# Altium schematic sheet Microprocessor and CAN.SchDoc
size B; SheetNumber: 1; SheetTotal: 3
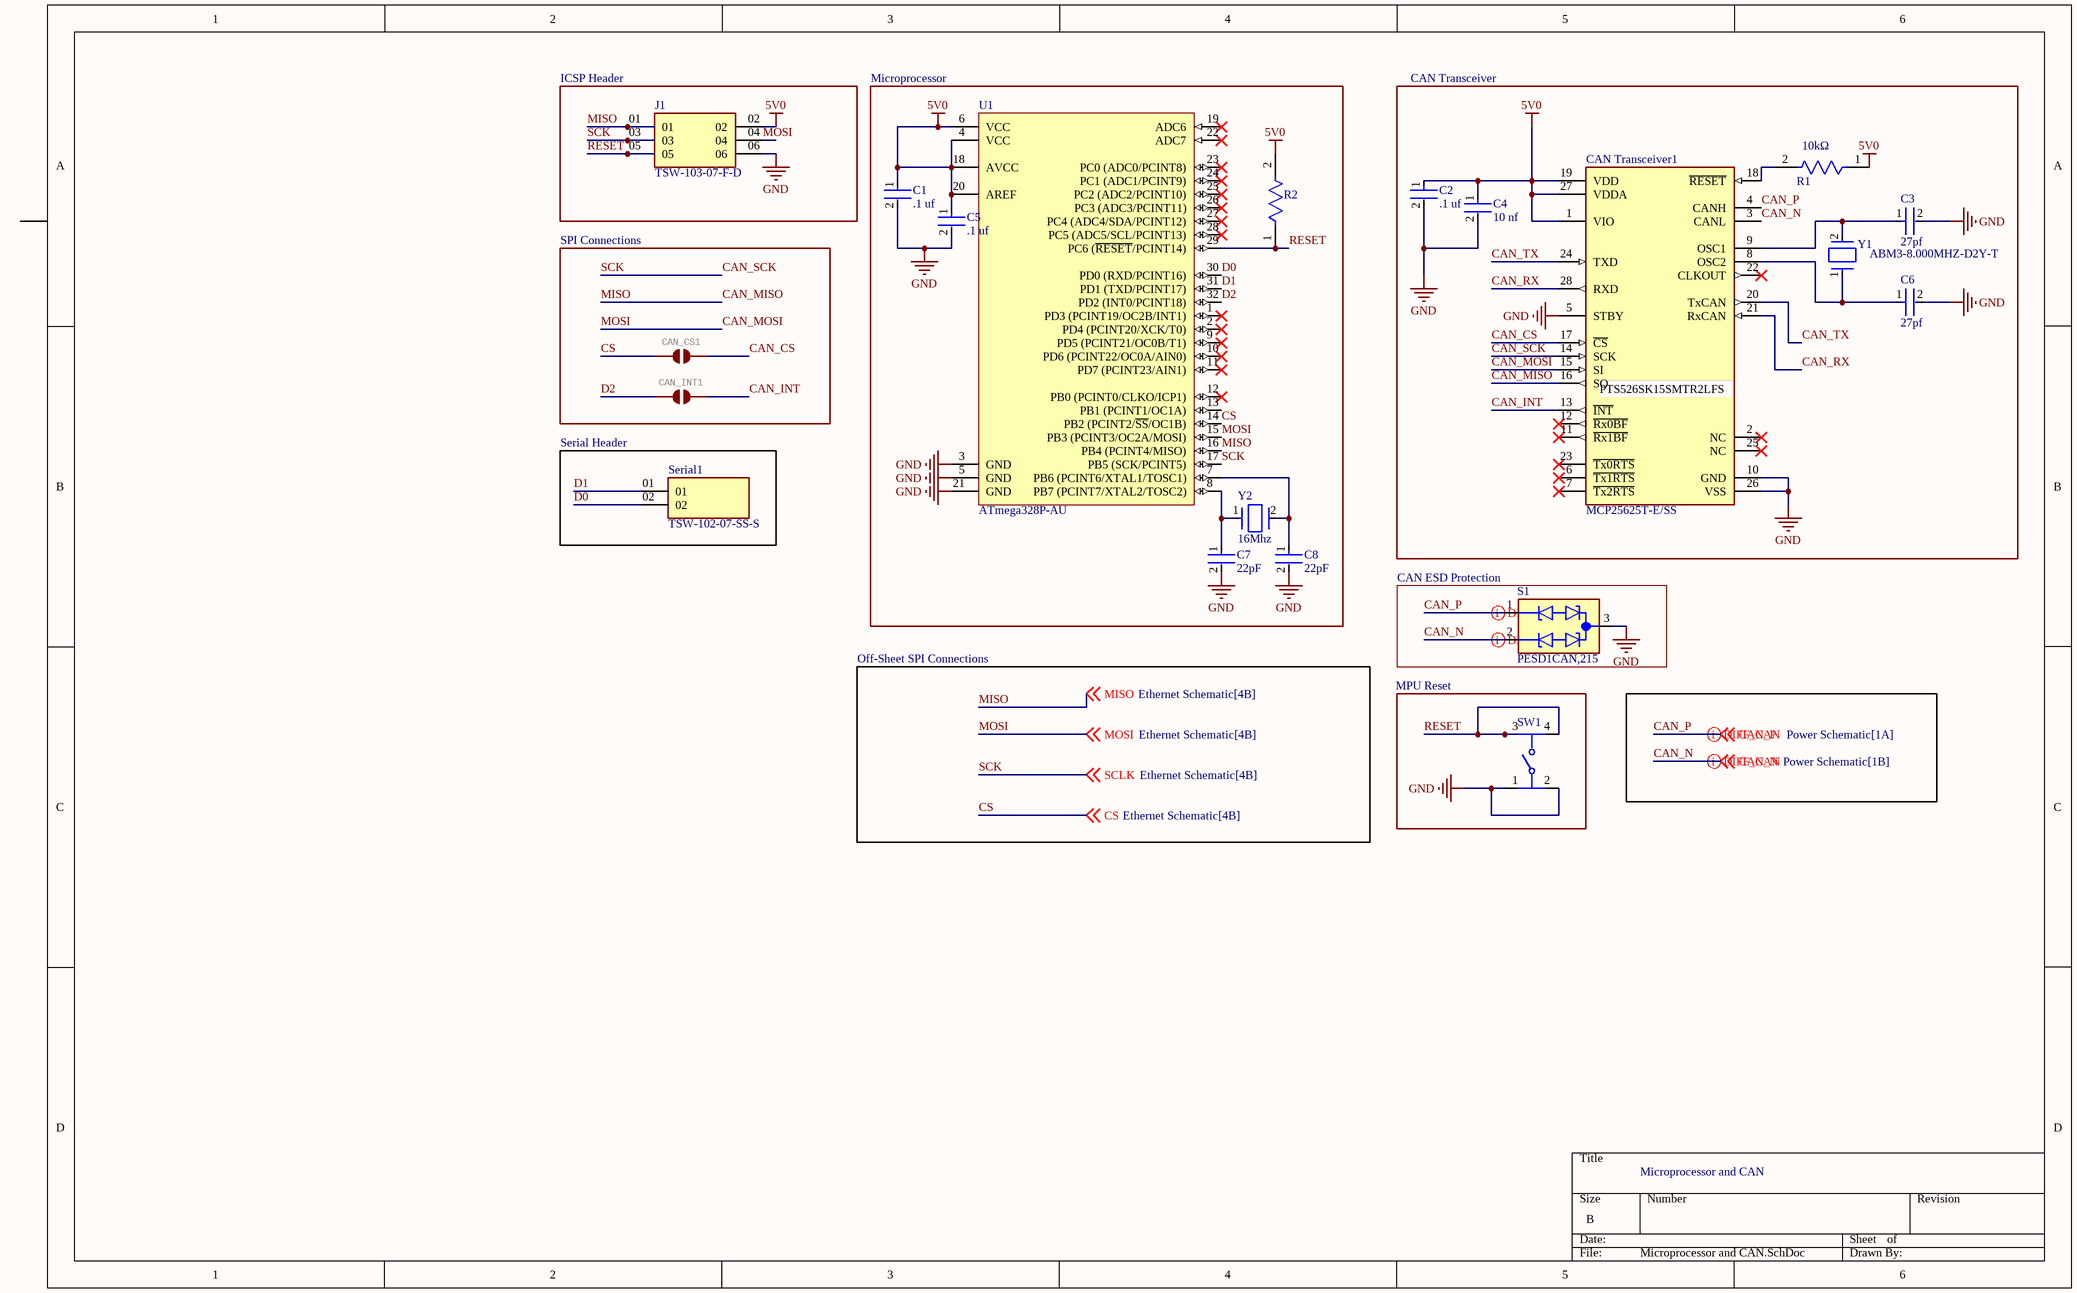
[diagram p0: Microprocessor and CAN.SchDoc]

## Parts
C1  .1 uf  [FP-0805-L_2_01_0_2-W_1_25-IPC_B]
C2  .1 uf  [FP-0805-L_2_01_0_2-W_1_25-IPC_B]
C3  27pf  [FP-GRM21B-0_15-IPC_C]
C4  10 nf  [FP-C0805C-DN-MFG]
C5  .1 uf  [FP-0805-L_2_01_0_2-W_1_25-IPC_B]
C6  27pf  [FP-GRM21B-0_15-IPC_C]
C7  22pF  [FP-C0805C-DN-MFG]
C8  22pF  [FP-C0805C-DN-MFG]
CAN_CS1  (no value)  [SMT-JUMPER_2_NO_SILK]
CAN_INT1  (no value)  [SMT-JUMPER_2_NO_SILK]
CAN_Transceiver1  MCP25625T-E/SS  [FP-C04-073-IPC_B]
J1  TSW-103-07-F-D  [SAMTEC_TSW-103-07-F-D]
R1  10kΩ  [FP-CRCW0805-e3-IPC_A]
R2  CRCW080510K0FKEA  [FP-CRCW0805-e3-IPC_A]  (value not drawn)
S1  PESD1CAN,215  [DIO_PESD1CAN,215]
Serial1  TSW-102-07-SS-S  [SAMTEC_TSW-102-07-SS-S]
SW1  PTS526SK15SMTR2LFS  [FP-PTS526SK15SMTR2LFS-MFG]  (value not drawn)
U1  ATmega328P-AU  [32A_M]
Y1  ABM3-8.000MHZ-D2Y-T  [FP-ABM3-MFG]
Y2  16Mhz  [FP-ABM3-MFG]

## Blocks framed on the sheet
ICSP Header: J1
Microprocessor: C1 C5 C7 C8 R2 U1 Y2
CAN Transceiver: C2-C4 C6 CAN_Transceiver1 R1 Y1
SPI Connections: CAN_CS1 CAN_INT1
Serial Header: Serial1
CAN ESD Protection: S1
MPU Reset: SW1

## Nets
5V0: C1.1 C2.1 C4.1 C5.1 CAN_Transceiver1.1(VIO) CAN_Transceiver1.19(VDD) CAN_Transceiver1.27(VDDA) J1.02 R1.1 R2.2 U1.4(VCC) U1.6(VCC) U1.18(AVCC) U1.20(AREF)
GND: C1.2 C2.2 C3.2 C4.2 C5.2 C6.2 C7.2 C8.2 CAN_Transceiver1.5(STBY) CAN_Transceiver1.10(GND) CAN_Transceiver1.26(VSS) J1.06 S1.3(CC) SW1.1 SW1.2 U1.3(GND) U1.5(GND) U1.21(GND)
CAN_CS: CAN_CS1.2 CAN_Transceiver1.17(~{CS})
CAN_INT: CAN_INT1.2 CAN_Transceiver1.13(~{INT})
CAN_MISO: CAN_Transceiver1.16(SO) J1.01 U1.16(PB4_(PCINT4/MISO)) ; off-sheet MISO  [also labelled MISO]
CAN_MOSI: CAN_Transceiver1.15(SI) J1.04 U1.15(PB3_(PCINT3/OC2A/MOSI)) ; off-sheet MOSI  [also labelled MOSI]
CAN_N: CAN_Transceiver1.3(CANL) S1.2(C2) ; off-sheet CAN_N
CAN_P: CAN_Transceiver1.4(CANH) S1.1(C1) ; off-sheet CAN_P
CAN_RX: CAN_Transceiver1.21(RxCAN) CAN_Transceiver1.28(RXD)
CAN_SCK: CAN_Transceiver1.14(SCK) J1.03 U1.17(PB5_(SCK/PCINT5)) ; off-sheet SCLK  [also labelled SCK, SCLK]
CAN_TX: CAN_Transceiver1.20(TxCAN) CAN_Transceiver1.24(TXD)
CS: CAN_CS1.1 U1.14(PB2_(PCINT2/~{SS}/OC1B)) ; off-sheet CS
D0: Serial1.02 U1.30(PD0_(RXD/PCINT16))
D1: Serial1.01 U1.31(PD1_(TXD/PCINT17))
D2: CAN_INT1.1 U1.32(PD2_(INT0/PCINT18))
RESET: J1.05 R2.1 SW1.3 SW1.4 U1.29(PC6_(~{RESET}/PCINT14))
NetC3_1: C3.1 CAN_Transceiver1.9(OSC1) Y1.2
NetC6_1: C6.1 CAN_Transceiver1.8(OSC2) Y1.1
NetC7_1: C7.1 U1.8(PB7_(PCINT7/XTAL2/TOSC2)) Y2.1
NetC8_1: C8.1 U1.7(PB6_(PCINT6/XTAL1/TOSC1)) Y2.2
NetCAN_Transceiver1_18: CAN_Transceiver1.18(~{RESET}) R1.2

Not connected (* = marked no-connect by the designer): CAN_Transceiver1 2(NC)* 6(~{Tx1RTS})* 7(~{Tx2RTS})* 11(~{Rx1BF})* 12(~{Rx0BF})* 22(CLKOUT)* 23(~{Tx0RTS})* 25(NC)*; U1 1(PD3_(PCINT19/OC2B/INT1))* 2(PD4_(PCINT20/XCK/T0))* 9(PD5_(PCINT21/OC0B/T1))* 10(PD6_(PCINT22/OC0A/AIN0))* 11(PD7_(PCINT23/AIN1))* 12(PB0_(PCINT0/CLKO/ICP1))* 13(PB1_(PCINT1/OC1A)) 19(ADC6)* 22(ADC7)* 23(PC0_(ADC0/PCINT8))* 24(PC1_(ADC1/PCINT9))* 25(PC2_(ADC2/PCINT10))* 26(PC3_(ADC3/PCINT11))* 27(PC4_(ADC4/SDA/PCINT12))* 28(PC5_(ADC5/SCL/PCINT13))*

## Layout directives
differential pair: CAN_N, CAN_P

## Notes on the sheet
- (near CAN_Transceiver1) PTS526SK15SMTR2LFS
- Off-Sheet SPI Connections
- Microprocessor and CAN

## Library data of the parts
C1 C2 C5 = CMP-2007-04174-2: General Purpose Ceramic Capacitor, 0805, 100nF, 10%, X7R, 15%, 100V; Packaging: Tape and Reel; Min Operating Temperature: -55°C; Dielectric Material: Ceramic; Height: 1.4mm; Voltage Rating: 100V; Termination: SMD/SMT; Case Code (Imperial): 0805; Case Code (Metric): 2012; Case/Package: 0805; Construction: Flat; Radiation Hardening: No; Series: -; Dielectric: X7R; Package Quantity: 2000; Mount: Surface Mount; Capacitance: 100nF; Contact Plating: Tin; Voltage: 100V; Lead Free: Lead Free; Depth: 1.25mm; RoHS Compliant: Yes; Number of Pins: 2; Max Operating Temperature: 125°C; Length: 2.01mm; Voltage Rating (DC): 100V; Thickness: 0.055inch; REACH SVHC: No SVHC; Width: 0.049inch; Tolerance: 10%
C3 C6 = CMP-2007-03541-2: Chip Multilayer Ceramic Capacitors for General Purpose, 0805, 10uF, X5R, 15%, 10%, 25V; Length: 2mm; Depth: 1.25mm; Termination: SMD/SMT; Voltage: 25V; Height: 1.25mm; Material: Ceramic; Thickness: 0.053inch; Radiation Hardening: No; Min Operating Temperature: -55°C; Width: 0.049inch; Package Quantity: 1; Mount: Surface Mount; Dielectric: X5R; Packaging: Tape and Reel; Capacitance: 10uF; Voltage Rating (DC): 25V; Lead Free: Lead Free; Max Operating Temperature: 85°C; Case Code (Imperial): 0805; Case/Package: 0805; Tolerance: 10%; Voltage Rating: 25V; Case Code (Metric): 2012
C4 = CMP-2007-00259-2: CAP CER 10000PF 200V X7R 0805; Manufacturer Part Number: C0805C103K2RACTU; Manufacturer: KEMET; Material: Ceramic; Temperature Coefficient: 30ppm/°C; Capacitance: 10,000 pF; Tolerance: 0.1; Value: 10,000 pF; Device Class L2: Capacitors; Voltage Rating: 200 V; Temperature Range High: +125°C; ComponentLink2Description: Datasheet; Height: 0.88mm; Octopart: https://octopart.com/c0805c103k2ractu-kemet-9138347; ComponentLink2URL: https://content.kemet.com/datasheets/KEM_C1003_C0G_SMD.pdf; Category: Cap; Temperature: -55°C to +125°C; Temperature Range Low: -55°C; Digikey Description: CAP CER 10000PF 200V X7R 0805; Temperature Characteristic: X7R; Automotive: No; Device Class L3: Ceramic Capacitors; Mouser Description: KEMET - C0805C103K2RACTU - CAP, MLCC, X7R, 10NF, 200V, 0805; RoHS: TRUE; Device Class L1: Passive Components; Lead Free: Yes; Package: C0805C-DN; Ipc Land Pattern Name: CAPC200125X78
C7 C8 = CMP-2007-00048-2: Capacitor; Ceramic; Cap; 22.0pF; Tol 5%; SMT; Vol-Rtg 50V; C0G; Tape and Reel; Manufacturer: KEMET; Manufacturer Part Number: C0805C220J5GACTU; Temperature Coefficient: 30ppm/°C; Tolerance: 0.05; Device Class L1: Passive Components; Mouser Description: Multilayer Ceramic Capacitors MLCC - SMD/SMT 50volts 22pF C0G 5%; Temperature Range Low: -55°C; Automotive: No; Voltage Rating: 50 V; Material: Ceramic; Category: Cap; Height: 0.88mm; Temperature Range High: +125°C; Capacitance: 22 pF; Digikey Description: Capacitor; Ceramic; Cap; 22.0pF; Tol 5%; SMT; Vol-Rtg 50V; C0G; Tape and Reel; Octopart: https://octopart.com/c0805c220j5gactu-kemet-145470; ComponentLink2Description: Datasheet; Device Class L2: Capacitors; Ipc Land Pattern Name: CAPC200125X78; Value: 22 pF; RoHS: TRUE; ComponentLink2URL: https://content.kemet.com/datasheets/KEM_C1003_C0G_SMD.pdf; Temperature: -55°C to +125°C; Device Class L3: Ceramic Capacitors; Lead Free: Yes; Temperature Characteristic: C0G; Package: C0805C-DN
CAN_CS1 CAN_INT1 = JUMPER-SMT_2_NO_SILK: GateName_1: G$1; SymbolName_1: SMT-JUMPER_2_NO; DeviceName: _SILK; LibraryName: SparkFun-Jumpers; DeviceSetName: JUMPER-SMT_2_NO; Package: SMT-JUMPER_2_NO_SILK
CAN_Transceiver1 = CMP-06279-000016-1: 1/1 Transceiver CANbus 28-SSOP; Max Supply Voltage: 5.5V; Number of Receivers: 1; Receiver Hysteresis: 200mV; Data Rate: 1Mbps; Min Supply Voltage: 4.5V; Propagation Delay: 125ns; Operating Supply Current: 70mA; Interface: SPI; Case/Package: SSOP; Max Operating Temperature: 125°C; Weight: 0.080001oz; Mount: Surface Mount; RoHS Compliant: Yes; Package Quantity: 2100; Packaging: Tape and Reel; Min Operating Temperature: -40°C; Number of Pins: 28; Number of Drivers: 1; Number of Transceivers: 1; Manufacturer PN: MCP25625T-E/SS; Footprint 1: 28-SSOP
J1 = TSW-103-07-F-D: MF: {'manufacturer': u'Samtec'}; Package: None; Price: None; Value: *; MP: TSW-103-07-F-D; Availability: Unavailable
R1 R2 = CMP-2001-04908-2: RES Thick Film, 10kΩ, 1%, 0.125W, 100ppm/°C, 0805; Resistance: 10kR; Voltage Rating (DC): 150V; Power Rating: 125mW; Weight: 0.000194oz; Package Quantity: 5000; Military Standard: Not; Max Operating Temperature: 155°C; Temperature Coefficient: 100ppm/°C; Contact Plating: Tin; Width: 1.25mm; Height: 0.45mm; Radiation Hardening: No; Tolerance: 1%; Min Operating Temperature: -55°C; Voltage Rating: 150V; Length: 2mm; Depth: 1.25mm; Termination: SMD/SMT; Packaging: Tape and Reel; Case/Package: 0805; Case Code (Metric): 2012; Lead Free: Lead Free; Case Code (Imperial): 0805; Composition: Thick Film
S1 = PESD1CAN,215: <a href="https://pricing.snapeda.com/parts/PESD1CAN,215/Nexperia%20USA%20Inc./view-part?ref=eda">Check availability</a>; MF: {'manufacturer': u'Nexperia USA Inc.'}; Package: None; Price: None; Value: *; MP: PESD1CAN,215; Availability: Unavailable
Serial1 = TSW-102-07-SS-S: MF: {'manufacturer': u'Samtec'}; Package: None; Price: None; Value: *; MP: TSW-102-07-SS-S; Availability: Unavailable
SW1 = CMP-10040-000013-1: TACT 5.2 X 5.2, 1.5 MM H, 260GF,; Manufacturer: C&K; Operating Force: 250gf; Throw Configuration: SPST-NO; Contact Current Rating: 50mA; Standoff Height: 0mm; Contact Resistance: 100mΩ; Voltage Rating Dc: 12V; Electromechanical Life: 200000Cycles; Device Class L3: Tactile Switches; Device Class L2: Switches; Temperature: -20°C to +70°C; Temperature Range Low: -20°C; Package: PTS526SK15SMTR2LFS; Temperature Range High: +70°C; ComponentLink2Description: Datasheet; Device Class L1: Electromechanical; Height: 1.65mm; Digikey Description: TACT 5.2 X 5.2, 1.5 MM H, 260GF,; Category: Switch; RoHS: TRUE; Automotive: No; Lead Free: Yes; Manufacturer Part Number: PTS526SK15SMTR2LFS; Octopart: https://octopart.com/pts526+sk15+smtr2+lfs-c%26k+components-100617999; ComponentLink2URL: https://www.ckswitches.com/media/2780/pts526.pdf
U1 = CMP-0095-00269-2: 8-bit AVR Microcontroller, 32KB Flash, 1KB EEPROM, 2KB SRAM, 32-pin TQFP, Industrial Grade (-40°C to 85°C); PackageDescription: 32-Lead, 7x7x1.0 mm Body, 0.8mm Lead Pitch, Thin Profile Plastic Quad Flat Package (TQFP); DatasheetVersion: revD, May-2011; RevisionNote: DatasheetVersion & PackageVersion updated. URLs added.; ComponentLink1URL: http://www.atmel.com/; ComponentLink2Description: ATmega48A/48PA/88A/88PA/168A/168PA/328/328P Datasheet; Code_JEDEC: MS-026-ABA; ComponentLink1Description: Manufacturer URL; PackageReference: 32A; ComponentLink3Description: ATmega48A/48PA/88A/88PA/168A/168PA/328/328P Summary; ComponentLink2URL: http://www.atmel.com/dyn/resources/prod_documents/doc8271.pdf; PackageVersion: revC, Oct-2010; ComponentLink3URL: http://www.atmel.com/dyn/resources/prod_documents/8271S.pdf
Y1 = CMP-2000-05033-2: Crystal 8MHz ±20ppm 18pF SMD-2 5mm x 3.2mm; Series Resistance: 500R; Frequency Stability: 30ppm; ESR (Equivalent Series Resistance): 140R; Load Capacitance: 18pF; Height: 0.051inch; Tolerance: 20ppm; Depth: 3.2mm; Max Operating Temperature: 85°C; Frequency: 8MHz; Termination: SMD/SMT; Lead Free: Lead Free; Number of Pins: 2; Width: 3.2mm; RoHS Compliant: Yes; Resistor Type: Ceramic; Length: 5mm; Mount: Surface Mount; Case/Package: CSMD; Package Quantity: 1000; Radiation Hardening: No; Min Operating Temperature: -40°C; Packaging: Tape and Reel; Frequency Tolerance: 20ppm
Y2 = CMP-27762-004490-1: Crystal 16MHz ±20ppm 18pF SMD-2 5mm x 3.2mm; Frequency Stability: 30ppm; Series Resistance: 40R; Tolerance: 20ppm; Frequency Tolerance: 20ppm; Load Capacitance: 18pF; Resistor Type: Ceramic; Termination: SMD/SMT; Width: 0.126inch; Mount: Surface Mount; RoHS Compliant: Yes; Package Quantity: 1000; Height: 0.051inch; Length: 0.197inch; Frequency: 16MHz; Operating Frequency: 16 MHz; Packaging: Tape and Reel; Max Operating Temperature: 85°C; Series: ABM3; Case/Package: SMD/SMT; Lead Free: Lead Free; ESR (Equivalent Series Resistance): 40R; Number of Pins: 2; Min Operating Temperature: -40°C